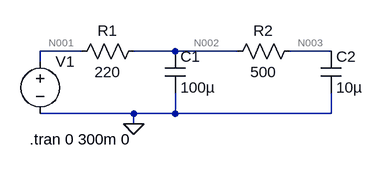
[diagram p0: schematic LP_sqtodc.asc]
LP_sqtodc.asc, the LTspice schematic file:
Version 4
SHEET 1 880 680
WIRE 112 192 48 192
WIRE 256 192 192 192
WIRE 352 192 256 192
WIRE 496 192 432 192
WIRE 48 208 48 192
WIRE 192 288 48 288
WIRE 256 288 256 256
WIRE 256 288 192 288
WIRE 496 288 496 256
WIRE 496 288 256 288
WIRE 192 304 192 288
FLAG 192 304 0
SYMBOL cap 240 192 R0
SYMATTR InstName C1
SYMATTR Value 100µ
SYMBOL res 208 176 R90
WINDOW 0 0 56 VBottom 2
WINDOW 3 32 56 VTop 2
SYMATTR InstName R1
SYMATTR Value 220
SYMBOL voltage 48 192 R0
WINDOW 3 24 96 Invisible 2
WINDOW 123 0 0 Left 2
WINDOW 39 0 0 Left 2
SYMATTR Value PULSE(0 5 1n 1n 1n 0.5m 1m)
SYMATTR InstName V1
SYMBOL res 448 176 R90
WINDOW 0 0 56 VBottom 2
WINDOW 3 32 56 VTop 2
SYMATTR InstName R2
SYMATTR Value 500
SYMBOL cap 480 192 R0
SYMATTR InstName C2
SYMATTR Value 10µ
TEXT 32 328 Left 2 !.tran 0 300m 0

The netlist it stands for:
* LP_sqtodc.asc
C1 N002 0 100µ
R1 N002 N001 220
V1 N001 0 PULSE(0 5 1n 1n 1n 0.5m 1m)
R2 N003 N002 500
C2 N003 0 10µ
.tran 0 300m 0
.backanno
.end

* Results of the author's LTspice run, read from the files saved beside the schematic
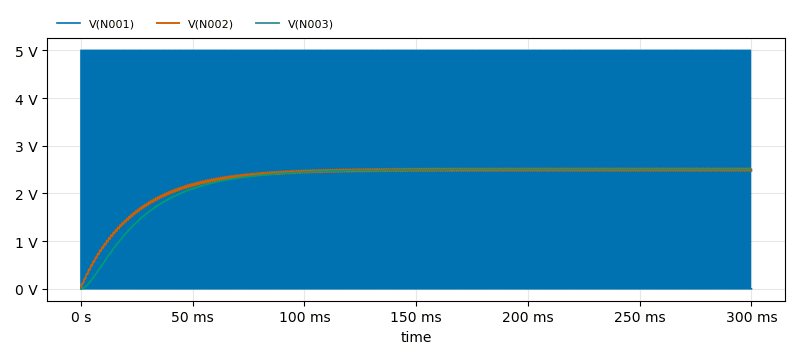
[diagram p1: Transient Analysis of LP_sqtodc.asc, plotted from the saved traces]
* Transient Analysis, 1 run:
*   V(N001): min 0 V, max 5 V, average 2.5 V, rms 3.536 V, last 0 V
*   V(N002): min 0 V, max 2.528 V, average 2.3 V, rms 2.344 V, last 2.472 V
*   V(N003): min 0 V, max 2.501 V, average 2.259 V, rms 2.32 V, last 2.5 V